# EAGLE design MotorDriverModule (EAGLE 9.6.2)
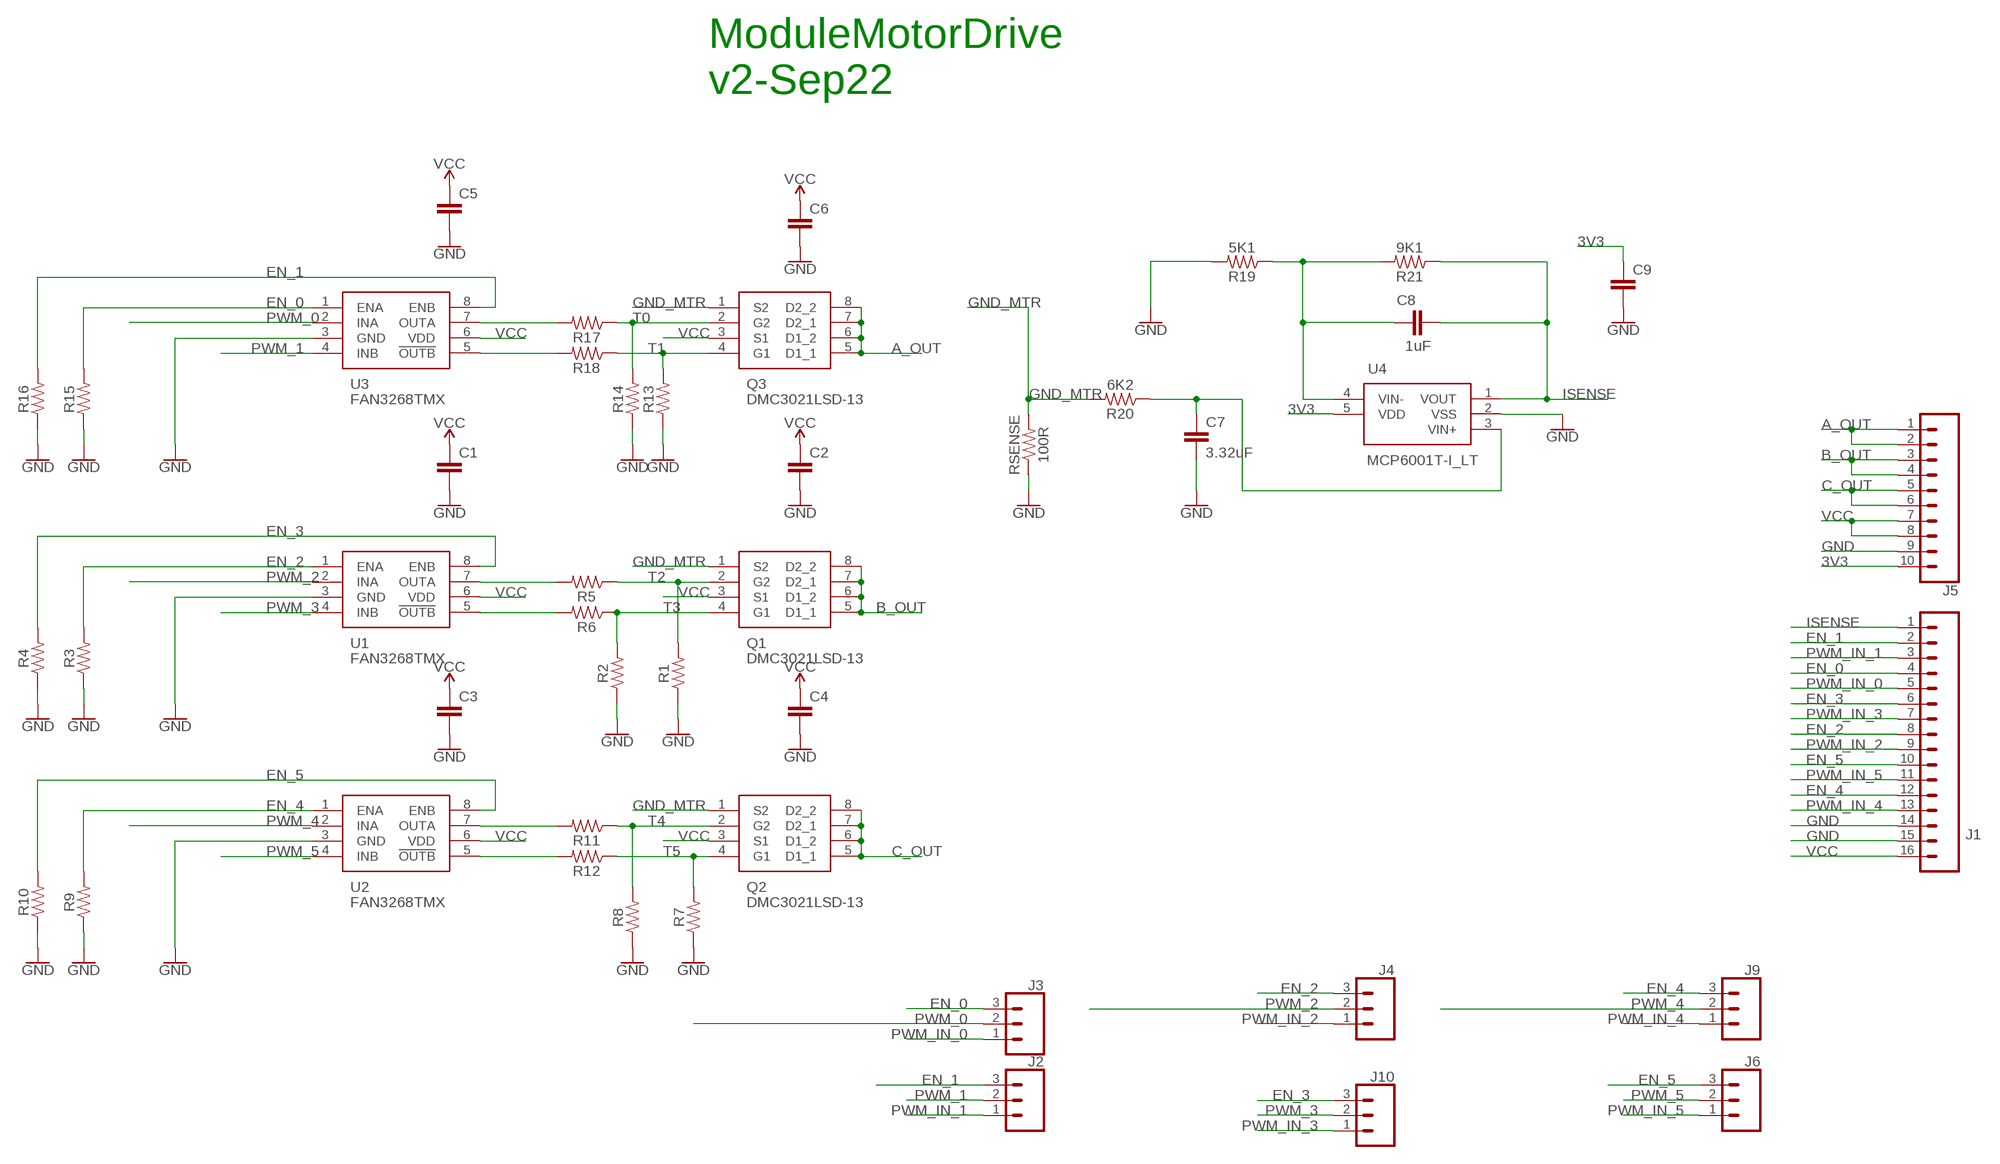
[diagram p0: schematic, sheet 1]

## Parts
C1  C-EUC0805  [C0805]
C2  C-EUC0805  [C0805]
C3  C-EUC0805  [C0805]
C4  C-EUC0805  [C0805]
C5  C-EUC0805  [C0805]
C6  C-EUC0805  [C0805]
C7  3.32uF  C-EUC0805  [C0805]
C8  1uF  C-EUC0805  [C0805]
C9  C-EUC0805  [C0805]
J1  CONN_16  [1X16]
J2  CONN_03  [1X03]
J3  CONN_03  [1X03]
J4  CONN_03  [1X03]
J5  CONN_10"  [1X10]
J6  CONN_03  [1X03]
J9  CONN_03  [1X03]
J10  CONN_03  [1X03]
Q1  DMC3021LSD-13  [SOIC127P600X175-8N]
Q2  DMC3021LSD-13  [SOIC127P600X175-8N]
Q3  DMC3021LSD-13  [SOIC127P600X175-8N]
R1  RESISTOR0805  [0805]
R2  RESISTOR0805  [0805]
R3  RESISTOR0805  [0805]
R4  RESISTOR0805  [0805]
R5  RESISTOR0805  [0805]
R6  RESISTOR0805  [0805]
R7  RESISTOR0805  [0805]
R8  RESISTOR0805  [0805]
R9  RESISTOR0805  [0805]
R10  RESISTOR0805  [0805]
R11  RESISTOR0805  [0805]
R12  RESISTOR0805  [0805]
R13  RESISTOR0805  [0805]
R14  RESISTOR0805  [0805]
R15  RESISTOR0805  [0805]
R16  RESISTOR0805  [0805]
R17  RESISTOR0805  [0805]
R18  RESISTOR0805  [0805]
R19  5K1  RESISTOR0805  [0805]
R20  6K2  RESISTOR0805  [0805]
R21  9K1  RESISTOR0805  [0805]
RSENSE  100R  RESISTOR1206  [1206]
U1  FAN3268TMX  [SOIC127P600X175-8N]
U2  FAN3268TMX  [SOIC127P600X175-8N]
U3  FAN3268TMX  [SOIC127P600X175-8N]
U4  MCP6001T-I_LT  [SOT65P210X110-5N]

## Nets
3V3: C9.1 J5.10 U4.5(VDD)
A_OUT: J5.1 J5.2 Q3.5(D1_1) Q3.6(D1_2) Q3.7(D2_1) Q3.8(D2_2)
B_OUT: J5.3 J5.4 Q1.5(D1_1) Q1.6(D1_2) Q1.7(D2_1) Q1.8(D2_2)
C_OUT: J5.5 J5.6 Q2.5(D1_1) Q2.6(D1_2) Q2.7(D2_1) Q2.8(D2_2)
EN_0: J1.4 J3.3 R15.2 U3.1(ENA)
EN_1: J1.2 J2.3 R16.2 U3.8(ENB)
EN_2: J1.8 J4.3 R3.2 U1.1(ENA)
EN_3: J1.6 J10.3 R4.2 U1.8(ENB)
EN_4: J1.12 J9.3 R9.2 U2.1(ENA)
EN_5: J1.10 J6.3 R10.2 U2.8(ENB)
GND: C1.2 C2.2 C3.2 C4.2 C5.2 C6.2 C7.2 C9.2 J1.14 J1.15 J5.9 R1.1 R2.1 R3.1 R4.1 R7.1 R8.1 R9.1 R10.1 R13.1 R14.1 R15.1 R16.1 R19.2 RSENSE.1 U1.3(GND) U2.3(GND) U3.3(GND) U4.2(VSS)
GND_MTR: Q1.1(S2) Q2.1(S2) Q3.1(S2) R20.2 RSENSE.2
ISENSE: C8.2 J1.1 R21.1 U4.1(VOUT)
N$2: C8.1 R19.1 R21.2 U4.4(VIN-)
N$3: C7.1 R20.1 U4.3(VIN+)
N$5: R6.2 U1.5(!OUTB)
N$6: R5.2 U1.7(OUTA)
N$14: R12.2 U2.5(!OUTB)
N$15: R11.2 U2.7(OUTA)
N$23: R18.2 U3.5(!OUTB)
N$24: R17.2 U3.7(OUTA)
PWM_0: J3.2 U3.2(INA)
PWM_1: J2.2 U3.4(INB)
PWM_2: J4.2 U1.2(INA)
PWM_3: J10.2 U1.4(INB)
PWM_4: J9.2 U2.2(INA)
PWM_5: J6.2 U2.4(INB)
PWM_IN_0: J1.5 J3.1
PWM_IN_1: J1.3 J2.1
PWM_IN_2: J1.9 J4.1
PWM_IN_3: J1.7 J10.1
PWM_IN_4: J1.13 J9.1
PWM_IN_5: J1.11 J6.1
T0: Q3.2(G2) R14.2 R17.1
T1: Q3.4(G1) R13.2 R18.1
T2: Q1.2(G2) R1.2 R5.1
T3: Q1.4(G1) R2.2 R6.1
T4: Q2.2(G2) R8.2 R11.1
T5: Q2.4(G1) R7.2 R12.1
VCC: C1.1 C2.1 C3.1 C4.1 C5.1 C6.1 J1.16 J5.7 J5.8 Q1.3(S1) Q2.3(S1) Q3.3(S1) U1.6(VDD) U2.6(VDD) U3.6(VDD)

## Notes on the sheet
- ModuleMotorDrive
  v2-Sep22

## Library data of the parts
C1-C9 = rcl:C-EU: CAPACITOR, European symbol; SPICEPREFIX: C
J1 = SparkFun-Connectors:CONN_16: Multi connection point. Often used as Generic Header-pin footprint for 0.1 inch spaced/style header connections On any of the 0.1 inch spaced packages, you can populate with these: Break Away Headers - Straight <https://www.sparkfun.com/products/116> (PRT-00116) Break Away Male Headers - Right Angle <https://www.sparkfun.com/products/553> (PRT-00553) Female Headers <https://www.sparkfun.com/products/115> (PRT-00115) Break Away Headers - Machine Pin <https://www.sparkfun.com/products/117> (PRT-00117) Break Away Female Headers - Swiss Machine Pin <https://www.sparkfun.com/products/743> (PRT-00743) For SCREWTERMINALS and SPRING TERMINALS visit here: Screw Terimnals on SparkFun.com <https://www.sparkfun.com/search/results?term=Screw+Terminals> (5mm/3.5mm/2.54mm spacing) This device is also useful as a general connection point to wire up your design to another part of your project. Our various solder wires solder well into these plated through hole pads. Hook-Up Wire - Assortment (Stranded, 22 AWG) <https://www.sparkfun.com/products/11375> (PRT-11375) Hook-Up Wire - Assortment (Solid Core, 22 AWG) <https://www.sparkfun.com/products/11367> (PRT-11367) View the entire wire category on our website here <https://www.sparkfun.com/categories/141> Special notes: Molex polarized connector foot print use with SKU : PRT-08231 with associated crimp pins and housings. 1MM SMD Version SKU: PRT-10208 NOTES ON THE VARIANTS LOCK and LOCK_LONGPADS... This footprint was designed to help hold the alignment of a through-hole component (i.e. 6-pin header) while soldering it into place. You may notice that each hole has been shifted either up or down by 0.005 of an inch from it's more standard position (which is a perfectly straight line). This slight alteration caused the pins (the squares in the middle) to touch the edges of the holes. Because they are alternating, it causes a "brace" to hold the component in place. 0.005 has proven to be the perfect amount of "off-center" position when using our standard breakaway headers. Although looks a little odd when you look at the bare footprint, once you have a header in there, the alteration is very hard to notice. Also,if you push a header all the way into place, it is covered up entirely on the bottom side.
J2-J4 J6 J9 J10 = SparkFun-Connectors:CONN_03: Multi connection point. Often used as Generic Header-pin footprint for 0.1 inch spaced/style header connections On any of the 0.1 inch spaced packages, you can populate with these: Break Away Headers - Straight <https://www.sparkfun.com/products/116> (PRT-00116) Break Away Male Headers - Right Angle <https://www.sparkfun.com/products/553> (PRT-00553) Female Headers <https://www.sparkfun.com/products/115> (PRT-00115) Break Away Headers - Machine Pin <https://www.sparkfun.com/products/117> (PRT-00117) Break Away Female Headers - Swiss Machine Pin <https://www.sparkfun.com/products/743> (PRT-00743) Stackable Header - 3 Pin (Female, 0.1") <https://www.sparkfun.com/products/13875> (PRT-13875) For SCREWTERMINALS and SPRING TERMINALS visit here: Screw Terimnals on SparkFun.com <https://www.sparkfun.com/search/results?term=Screw+Terminals> (5mm/3.5mm/2.54mm spacing) This device is also useful as a general connection point to wire up your design to another part of your project. Our various solder wires solder well into these plated through hole pads. Hook-Up Wire - Assortment (Stranded, 22 AWG) <https://www.sparkfun.com/products/11375> (PRT-11375) Hook-Up Wire - Assortment (Solid Core, 22 AWG) <https://www.sparkfun.com/products/11367> (PRT-11367) View the entire wire category on our website here <https://www.sparkfun.com/categories/141> Special notes: Molex polarized connector foot print use with SKU : PRT-08232 with associated crimp pins and housings.
J5 = SparkFun-Connectors:CONN_10: Multi connection point. Often used as Generic Header-pin footprint for 0.1 inch spaced/style header connections On any of the 0.1 inch spaced packages, you can populate with these: Break Away Headers - Straight <https://www.sparkfun.com/products/116> (PRT-00116) Break Away Male Headers - Right Angle <https://www.sparkfun.com/products/553> (PRT-00553) Female Headers <https://www.sparkfun.com/products/115> (PRT-00115) Break Away Headers - Machine Pin <https://www.sparkfun.com/products/117> (PRT-00117) Break Away Female Headers - Swiss Machine Pin <https://www.sparkfun.com/products/743> (PRT-00743) Arduino Stackable Header - 10 Pin <https://www.sparkfun.com/products/11376> (PRT-11376) For SCREWTERMINALS and SPRING TERMINALS visit here: Screw Terimnals on SparkFun.com <https://www.sparkfun.com/search/results?term=Screw+Terminals> (5mm/3.5mm/2.54mm spacing) This device is also useful as a general connection point to wire up your design to another part of your project. Our various solder wires solder well into these plated through hole pads. Hook-Up Wire - Assortment (Stranded, 22 AWG) <https://www.sparkfun.com/products/11375> (PRT-11375) Hook-Up Wire - Assortment (Solid Core, 22 AWG) <https://www.sparkfun.com/products/11367> (PRT-11367) View the entire wire category on our website here <https://www.sparkfun.com/categories/141> Special notes: Molex polarized connector foot print use with SKU : PRT-08231 with associated crimp pins and housings. 1MM SMD Version SKU: PRT-10208 NOTES ON THE VARIANTS LOCK and LOCK_LONGPADS... This footprint was designed to help hold the alignment of a through-hole component (i.e. 6-pin header) while soldering it into place. You may notice that each hole has been shifted either up or down by 0.005 of an inch from it's more standard position (which is a perfectly straight line). This slight alteration caused the pins (the squares in the middle) to touch the edges of the holes. Because they are alternating, it causes a "brace" to hold the component in place. 0.005 has proven to be the perfect amount of "off-center" position when using our standard breakaway headers. Although looks a little odd when you look at the bare footprint, once you have a header in there, the alteration is very hard to notice. Also,if you push a header all the way into place, it is covered up entirely on the bottom side.; PROD_ID: CONN-11563
Q1-Q3 = DMC3021LSD-13:DMC3021LSD-13: MOSFET Dual N/P-Channel 30V 8.5A/7A SO8 Diodes Inc DMC3021LSD-13 Dual N/P-channel MOSFET Transistor, 8-Pin SOIC Source: Datasheet <https://www.diodes.com/assets/Datasheets/ds32152.pdf>; DESCRIPTION: MOSFET Dual N/P-Channel 30V 8.5A/7A SO8 Diodes Inc DMC3021LSD-13 Dual N/P-channel MOSFET Transistor, 8-Pin SOIC; HEIGHT: 1.75mm; MANUFACTURER_NAME: Diodes Inc.; MANUFACTURER_PART_NUMBER: DMC3021LSD-13; MOUSER_PART_NUMBER: 621-DMC3021LSD-13; MOUSER_PRICE-STOCK: https://www.mouser.co.uk/ProductDetail/Diodes-Incorporated/DMC3021LSD-13?qs=WZYOKEqGBpLz0mDfwbjxxA%3D%3D
R1-R21 RSENSE = SparkFun-Resistors:RESISTOR: Generic Resistor Package
U1-U3 = FAN3268TMX:FAN3268TMX: FAN3268TMX Source: Datasheet; ARROW_PART_NUMBER: FAN3268TMX; ARROW_PRICE-STOCK: https://www.arrow.com/en/products/fan3268tmx/on-semiconductor; DESCRIPTION: FAN3268TMX; HEIGHT: 1.75mm; MANUFACTURER_NAME: onsemi; MANUFACTURER_PART_NUMBER: FAN3268TMX; MOUSER_PART_NUMBER: 512-FAN3268TMX; MOUSER_PRICE-STOCK: https://www.mouser.co.uk/ProductDetail/ON-Semiconductor-Fairchild/FAN3268TMX/?qs=cjOFguiotuKeCt2NyaHM9g%3D%3D
U4 = MCP6001T-I_LT:MCP6001T-I_LT: Microchip MCP6001T-I/LT Low Power Op Amp, 1MHz Rail-Rail, 1.8 6 V, 5-Pin SC-70 Source: Datasheet <http://componentsearchengine.com/Datasheets/3/MCP6001T-I_LT.pdf>; ARROW_PART_NUMBER: MCP6001T-I/LT; ARROW_PRICE-STOCK: https://www.arrow.com/en/products/mcp6001t-ilt/microchip-technology?region=nac; DESCRIPTION: Microchip MCP6001T-I/LT Low Power Op Amp, 1MHz Rail-Rail, 1.8 6 V, 5-Pin SC-70; HEIGHT: 1.1mm; MANUFACTURER_NAME: Microchip; MANUFACTURER_PART_NUMBER: MCP6001T-I/LT; MOUSER_PART_NUMBER: 579-MCP6001T-I/LT; MOUSER_PRICE-STOCK: https://www.mouser.co.uk/ProductDetail/Microchip-Technology-Atmel/MCP6001T-I-LT?qs=Q%2Fw7XRh99il03y7Zr5Ze0Q%3D%3D

## Board
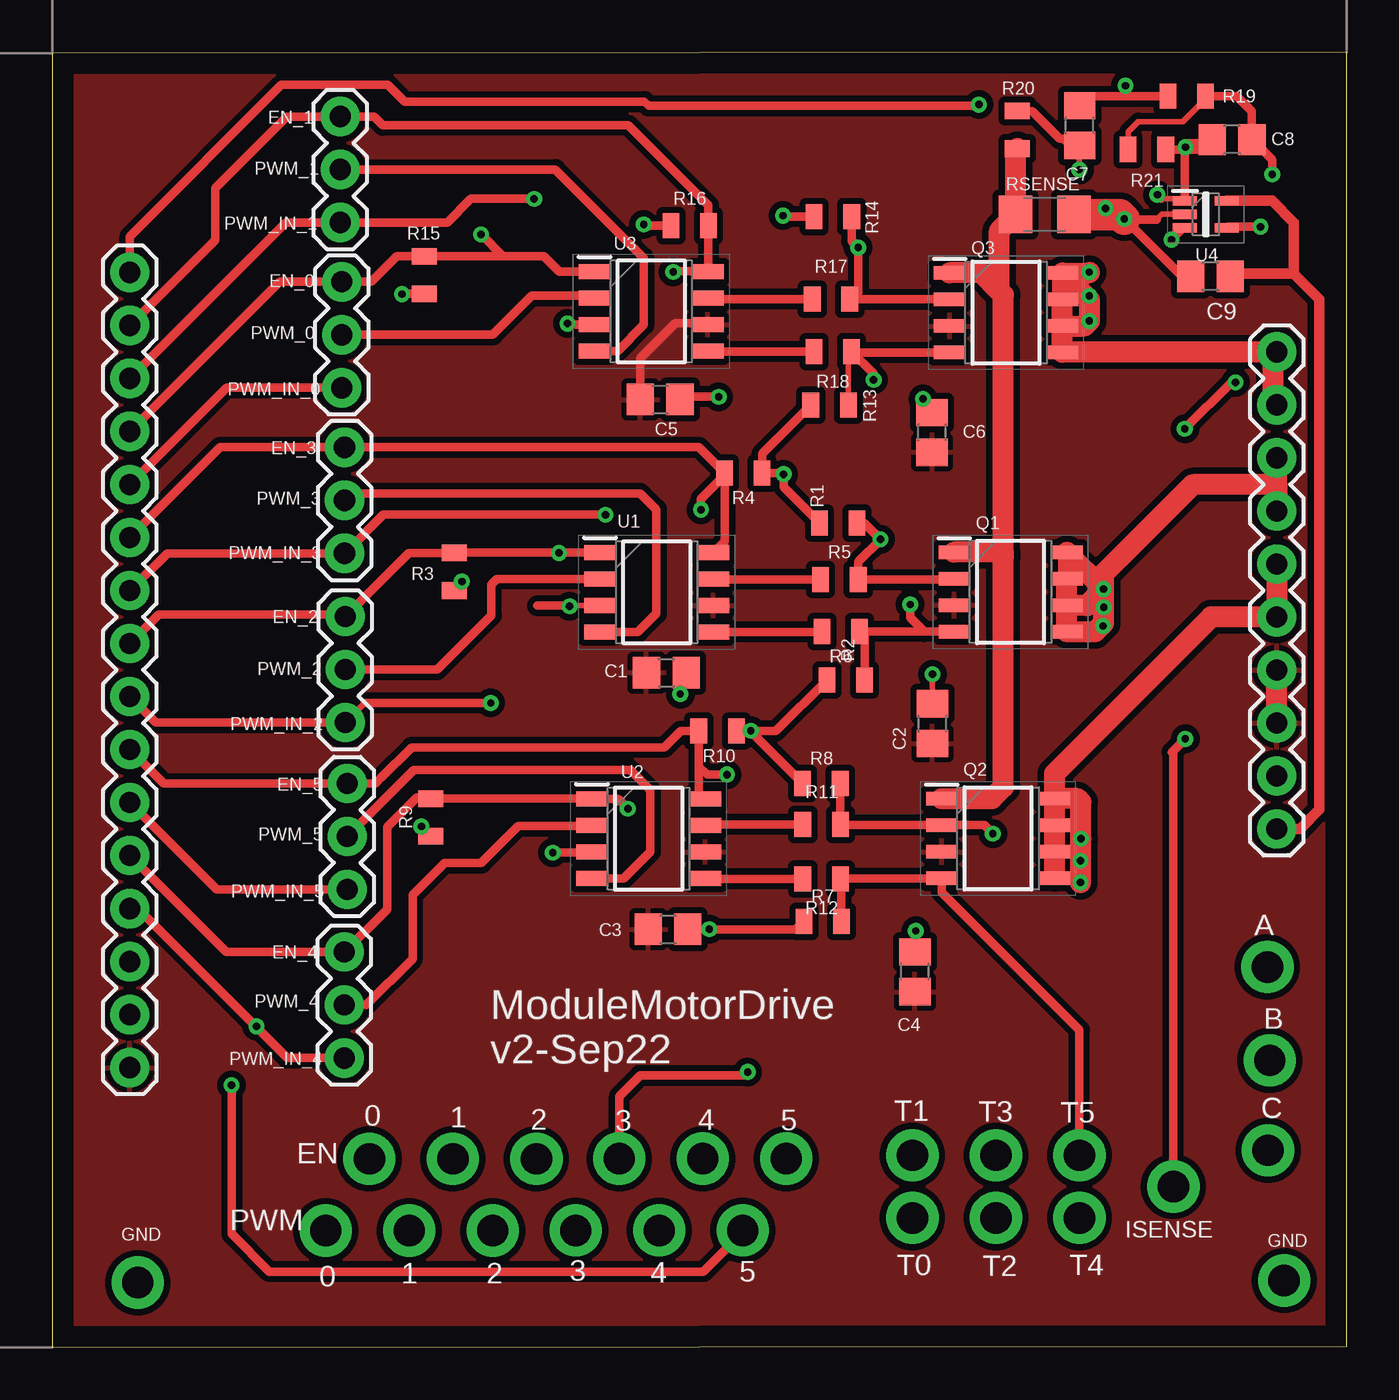
[diagram p1: board, top side]
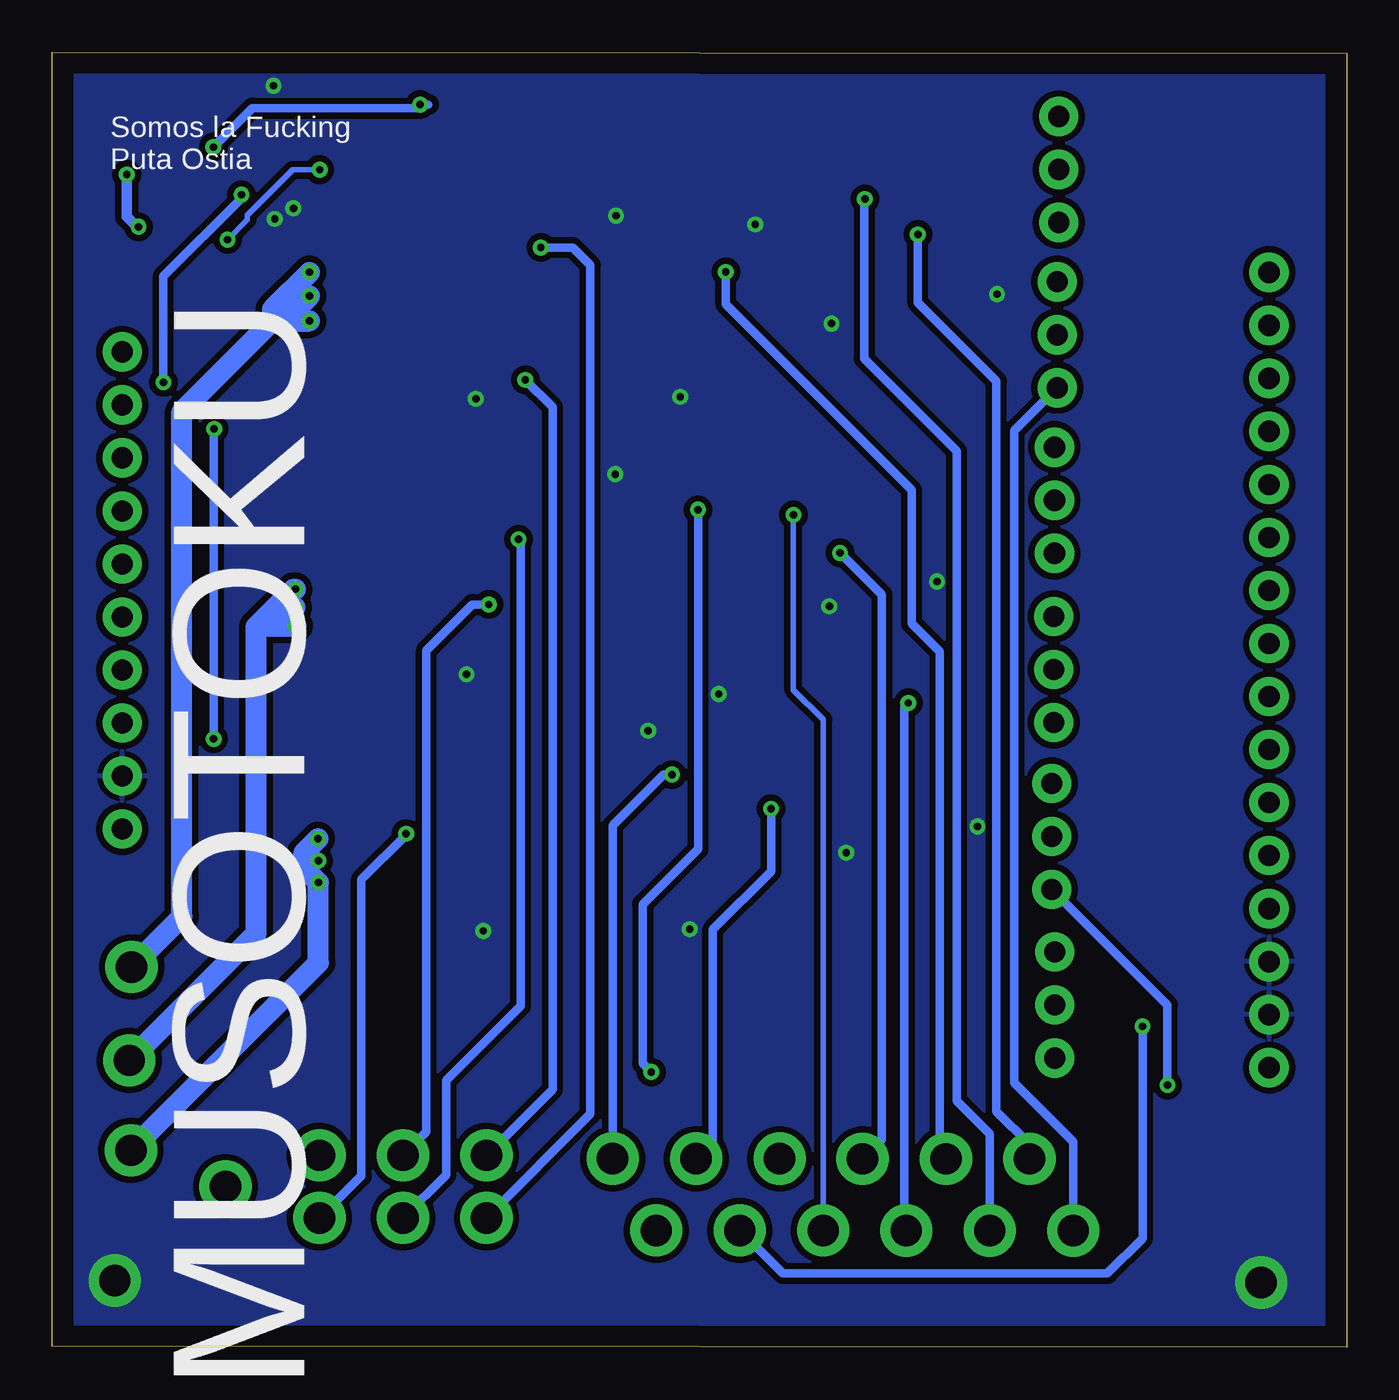
[diagram p2: board, bottom side, seen from below]

Size 62 x 62.05 mm. Coordinates in mm from the lower left corner, seen from the top.
Outline: 0,0 62,0.05 62,62.05 0,62 0,0
Copper layers (1*16): Top 0.035mm / dielectric 1.5mm / Bottom 0.035mm
Design rules "default *": minimum track width 6mil, minimum drill 0.35mm, track to track 12mil, track to pad 12mil, pad to pad 12mil, via to via 12mil, smd to smd 6mil, copper to edge 40mil, drill to drill 6mil, minimum pad ring 10mil, minimum via ring 8mil, stop-mask expansion 4mil, vias tented up to drill 0mil, thermal gap 10mil

### Footprints (pad centres in the part's own frame; a part is rotated, then mirrored left to right if it is on the bottom)
C0805 = smd 1.3 x 1.5: 1 -0.95,0; 2 0.95,0
1X16 = drill 1.016 pad 1.88: 1 0,0; 2 2.54,0; 3 5.08,0; 4 7.62,0; 5 10.16,0; 6 12.7,0; 7 15.24,0; 8 17.78,0; 9 20.32,0; 10 22.86,0; 11 25.4,0; 12 27.94,0; 13 30.48,0; 14 33.02,0; 15 35.56,0; 16 38.1,0
1X03 = drill 1.016 pad 1.88: 1 0,0; 2 2.54,0; 3 5.08,0
1X10 = drill 1.016 pad 1.88: 1 0,0; 2 2.54,0; 3 5.08,0; 4 7.62,0; 5 10.16,0; 6 12.7,0; 7 15.24,0; 8 17.78,0; 9 20.32,0; 10 22.86,0
SOIC127P600X175-8N = smd 1.5 x 0.65: 1 -2.7,1.905; 2 -2.7,0.635; 3 -2.7,-0.635; 4 -2.7,-1.905; 5 2.7,-1.905; 6 2.7,-0.635; 7 2.7,0.635; 8 2.7,1.905
0805 = smd 0.8 x 1.2: 1 -0.9,0; 2 0.9,0
1206 = smd 1.6 x 1.8: 1 -1.4,0; 2 1.4,0
SOIC127P600X175-8N' = smd 1.525 x 0.7: 1 -2.712,1.905; 2 -2.712,0.635; 3 -2.712,-0.635; 4 -2.712,-1.905; 5 2.712,-1.905; 6 2.712,-0.635; 7 2.712,0.635; 8 2.712,1.905
SOT65P210X110-5N = smd 1.15 x 0.45: 1 -1,0.65; 2 -1,0; 3 -1,-0.65; 4 1,-0.65; 5 1,0.65

### Placement (x,y rotation side)
C1  29.41,32.32 0 top
C2  42.16,29.88 90 top
C3  29.49,20.03 0 top
C4  41.32,17.99 90 top
C5  29.12,45.41 0 top
C6  42.14,43.83 90 top
C7  49.21,58.53 90 top
C8  56.51,57.86 180 top
C9  55.47,51.3 180 top
J1  3.72,51.5 270 top
J2  13.79,53.89 90 top
J3  13.87,45.97 90 top
J4  14.03,29.93 90 top
J5  58.65,47.69 270 top
J6  14.13,21.94 90 top
J9  13.99,13.86 90 top
J10  14,38.04 90 top
Q1  45.9,36.19 0 top
Q2  45.3,24.38 0 top
Q3  45.68,49.57 0 top
R1  37.65,39.5 0 top
R2  38.01,31.98 0 top
R3  19.25,37.16 90 top
R4  33.1,41.89 180 top
R5  37.7,36.79 180 top
R6  37.77,34.3 180 top
R7  36.9,20.41 0 top
R8  36.84,27.02 0 top
R9  18.14,25.39 90 top
R10  31.87,29.52 180 top
R11  36.85,25.05 180 top
R12  36.85,22.44 180 top
R13  37.23,45.14 0 top
R14  37.39,54.16 0 top
R15  17.81,51.37 90 top
R16  30.53,53.74 0 top
R17  37.3,50.22 180 top
R18  37.38,47.71 180 top
R19  54.34,59.93 180 top
R20  46.22,58.33 270 top
R21  52.43,57.39 180 top
RSENSE  47.54,54.27 180 top
U1  FAN3268TMX  [SOIC127P600X175-8N']  28.95,36.17 0 top
U2  FAN3268TMX  [SOIC127P600X175-8N']  28.56,24.37 0 top
U3  FAN3268TMX  [SOIC127P600X175-8N']  28.69,49.63 0 top
U4  55.25,54.28 0 top

### Tracks (layer width: path | path; a pad name or v marks a point on that pad's centre or on a via)
3V3
  Top 0.406: 56.57,51.45 C9.1
  Top 0.508: J5.10 59.76,24.83 60.69,25.76 60.69,50.22 59.46,51.45 | 59.46,51.45 56.57,51.45 | U4.5 58.42,54.93 59.46,53.89 59.46,51.45
A_OUT  (via drill 0.35, 1.5 pad 2.5)
  Top 0.254: J5.1 58.48,47.69 48.41,47.69 Q3.5 48.38,47.91 48.38,48.89 Q3.6 | 48.38,50.03 Q3.7
  Top 1.016: J5.2 58.48,45.32 58.48,47.69 | J5.1 48.6,47.69 48.38,47.91 | Q3.5 48.38,48.89 | 48.38,50.03 Q3.6 49.44,48.94 v49.67,49.17 49.67,50.19 Q3.8 | Q3.8 Q3.7 | Q3.8 49.64,51.48 v49.67,51.51
  Bottom 1.016: v58.2,18.22 55.79,20.63 55.79,44.83 51.45,49.17 | 51.45,49.17 v49.67,49.17 | v49.67,51.51 51.45,49.73 | 51.45,49.73 51.45,49.17 | v49.67,50.37 50.31,49.73 51.45,49.73
B_OUT  (via drill 0.35, 1.5 pad 2.5)
  Top 0.254: 48.6,36.63 Q1.7 | 48.6,35.53 Q1.6
  Top 1.016: Q1.6 48.6,36.63 | Q1.7 48.66,36.89 48.66,38.04 Q1.8 48.6,38.08 v50.35,36.33 | J5.3 J5.4 58.65,41.31 58.63,41.33 54.61,41.33 50.35,37.07 v50.35,36.33 | v50.35,36.33 49.55,35.53 48.6,35.53 Q1.5 49.94,34.29 50.35,34.69 v50.35,36.33
  Bottom 1.016: v58.31,13.75 52.23,19.83 52.23,34.53 52.2,34.56 | 52.2,34.56 50.43,36.33 v50.35,36.33 | 52.2,34.56 51.82,34.56 | 51.82,34.56 v50.33,34.56 | 51.82,34.56 50.92,35.46 v50.36,35.46
C_OUT  (via drill 0.35, 1.5 pad 2.5)
  Top 0.254: 48,26.57 Q2.8 | 48,25.11 Q2.7 | 48,23.89 Q2.6 | 48,22.64 Q2.5
  Top 1.016: J5.5 J5.6 55.51,34.99 48,27.48 48,26.57 | 48,25.11 Q2.8 49.11,26.29 49.27,26.12 v49.27,24.37 49.25,24.35 v49.25,23.31 v49.25,22.27 | Q2.7 48,23.89 | Q2.6 48,22.64
  Bottom 1.016: v58.23,9.44 49.25,18.42 v49.25,22.27 49.91,22.93 49.95,22.93 49.95,23.69 v49.27,24.37
EN_0  (via drill 0.35, 1.5 pad 2.5)
  Top 0.254: J3.3 14.05,51.05
  Top 0.406: 21.59,52.27 R15.2 16.5,52.27 15.28,51.05 14.05,51.05 10.89,51.05 J1.4 | 21.59,52.27 23.55,52.27 24.28,51.54 U3.1 | v20.54,53.32 21.59,52.27
  Bottom 0.406: v15.19,9.03 15.19,9.72 16.78,11.31 16.78,46.28 20.54,50.04 v20.54,53.32
EN_1  (via drill 0.35, 1.5 pad 2.5)
  Top 0.152: J2.3 12.42,58.97
  Top 0.254: 31.43,51.57 U3.8 | v29.74,51.52 29.79,51.57
  Top 0.406: 29.79,51.57 31.43,51.57 R16.2 31.43,54.71 27.59,58.55 15.84,58.55 15.42,58.97 12.42,58.97 11.24,58.97 7.8,55.53 7.8,53.04 J1.2
  Bottom 0.406: v19.19,9.03 19.5,9.34 19.5,33.34 20.84,34.68 20.84,41.07 29.74,49.97 v29.74,51.52
EN_2  (via drill 0.35, 1.5 pad 2.5)
  Top 0.254: R3.2 19.27,38.08 | 14.12,35.11 J4.3
  Top 0.406: 19.27,38.08 24.29,38.08 | 24.29,38.08 U1.1 | R3.2 17.08,38.06 14.12,35.11 5.1,35.11 J1.8 | v24.27,38.06 24.29,38.08
  Bottom 0.406: v23.19,9.03 22.27,9.95 22.27,36.06 v24.27,38.06
EN_3  (via drill 0.35, 1.5 pad 2.5)
  Top 0.254: R4.2 32.2,41.78
  Top 0.406: R4.2 30.97,43.12 J10.3 8.04,43.12 J1.6 | U1.8 32.2,38.61 32.2,41.78 31.07,40.65 v31.07,40.13 | v27.16,9.04 27.16,12.03 28.16,13.03 33.31,13.03 v33.31,13.19
  Bottom 0.406: v33.31,13.19 33.72,13.6 33.72,21.22 31.07,23.87 v31.07,40.13
EN_4  (via drill 0.35, 1.5 pad 2.5)
  Top 0.254: R9.2 18.08,26.35 17.47,26.35
  Top 0.406: 17.47,26.35 16.04,24.92 16.04,20.99 J9.3 8.34,18.94 J1.12 | R9.2 25.83,26.29 U2.1 27.1,26.27 v27.57,25.8
  Bottom 0.406: v31.16,9.04 30.36,9.84 30.36,20.01 27.57,22.8 v27.57,25.8
EN_5  (via drill 0.35, 1.5 pad 2.5)
  Top 0.406: 30.97,27.84 R10.2 30.1,29.52 29.32,28.74 17.21,28.74 15.74,27.27 15.49,27.02 J6.3 5.34,27.02 J1.10 | 30.97,27.84 30.97,26.58 U2.8 | v32.32,27.44 31.37,27.44 30.97,27.84
  Bottom 0.406: v35.16,9.04 35.16,25 32.72,27.44 v32.32,27.44
GND  (via drill 0.35, 1.5 pad 2.5)
  Top 0.254: v42.16,32.25 C2.2 | C5.2 30.2,45.54 | U1.3 24.82,35.54 v24.78,35.5 | v19.62,36.69 19.25,36.32 R3.1 | U2.3 25.82,23.7 | 33.46,29.52 v33.46,29.54 | 49.04,54.27 RSENSE.1 49.21,54.54 | U4.2 53.15,54.28 52.9,54.03 | 51.24,59.93 51.4,60.09 v51.4,60.45
  Top 0.406: C3.2 30.82,20.03 | 30.82,20.03 v31.46,20.04 v31.47,20.03 | v41.36,19.95 41.36,18.98 C4.2 | C1.2 30.08,32.04 v30.08,31.3 | v41.71,45.44 42.13,45.02 C6.2 | v31.92,45.54 30.2,45.54 | v17.68,24.95 R9.1 | R15.1 v16.76,50.47 v16.75,50.46 | 25.82,23.7 v23.97,23.7 | R10.1 33.46,29.52 | U3.3 24.73,49 v24.68,49.05 | R16.1 28.39,53.74 v28.33,53.8 | RSENSE.1 49.18,54.03 52.9,54.03 | 54.25,51.57 C9.2 54.12,51.3 51.36,54.06 v51.34,54.06 | 23.24,35.54 24.82,35.54 | C7.2 49.66,59.93 51.24,59.93 R19.2 | R13.1 34,42.81 R4.1 34.97,41.89 v35.03,41.83 35.03,41.22 R1.1 | R14.1 35.1,54.16 35.08,54.14 v35,54.22 | R2.1 34.65,29.52 33.46,29.52 | R8.1 33.46,29.5 33.46,29.52 | R7.1 35.62,20.03 30.82,20.03
  Top 1.5: v51.34,54.06 51.13,54.27 RSENSE.1
  other vias: 50.45,54.57 4.1,3.1 59,3.2
  pour Bottom (isolate 0.254): -1.17,62 62.8,62 62.8,0 -1.17,0
GND_MTR
  Top 1.016: Q2.1 45,26.29 45.55,26.84 45.55,37.88 45.55,38.1 | 45.55,38.1 Q1.1 | Q3.1 44.49,51.48 45.37,50.61 | 45.55,38.1 45.55,50.42 45.37,50.61 | R20.2 46.14,57.35 RSENSE.2 45.37,53.5 45.37,50.61
ISENSE  (via drill 0.35, 1.5 pad 2.5)
  Top 0.254: v54.28,57.5 54.28,57.7 | 53.7,28.43 53.62,28.51 | 54.25,55.04 53.11,55.04
  Top 0.406: U4.1 54.25,55.04 54.25,57.39 | 54.28,57.7 55.4,57.7 C8.2 55.09,57.39 54.25,57.39 | 54.25,57.39 R21.1 | v53.7,7.7 53.7,28.43 | 53.62,28.51 v54.27,29.15 | J1.1 3.72,53.22 10.98,60.48 16.08,60.48 16.88,59.68 28.36,59.68 28.57,59.48 44.32,59.48 v44.38,59.54 | v52.93,55.22 53.11,55.04 | v54.25,44.01 56.47,46.23 v56.67,46.23
  Bottom 0.254: 54.25,57.47 v54.28,57.5
  Bottom 0.406: v54.28,57.5 52.41,59.37 44.55,59.37 v44.38,59.54 43.98,59.54 | 3.66,51.56 J1.1 | v54.27,29.15 54.27,43.98 v54.25,44.01 | v56.67,46.23 56.67,51.32 52.93,55.06 v52.93,55.22
N$2  (via drill 0.35)
  Top 0.254: R21.2 51.53,58.23 52.02,58.72 54.17,58.72 54.17,58.75 55.24,59.82 R19.1
  Top 0.406: v58.43,56.19 58.43,56.89 C8.1 57.46,59.21 56.74,59.93 R19.1 | v57.87,53.69 56.31,53.69 U4.4
  Bottom 0.406: 57.9,53.65 v57.87,53.69
  Bottom 0.508: v58.43,56.19 58.43,54.18 57.9,53.65
N$3  (via drill 0.35)
  Top 0.254: R20.1 46.29,59.3 | U4.3 53.65,53.03 53.64,53.03 v53.6,53.07 | v49.19,56.42 49.19,57.15 49.19,57.56 C7.1
  Top 0.406: 49.19,57.15 48.44,57.9 48.26,57.9 46.93,59.23 R20.1
  Bottom 0.254: v53.6,53.07 52.65,54.02 52.65,54.24 50.48,56.41 v49.2,56.41 v49.19,56.42
N$5
  Top 0.254: R6.2 36.84,34.27
  Top 0.406: 36.84,34.27 U1.5
N$6
  Top 0.254: 31.68,36.79 U1.7
  Top 0.406: R5.2 31.68,36.79
N$14
  Top 0.254: 31.93,22.44 31.72,22.23 31.51,22.23 U2.5
  Top 0.406: R12.2 31.93,22.44
N$15
  Top 0.254: 31.32,25.05 U2.7
  Top 0.406: R11.2 31.32,25.05
N$23
  Top 0.254: 31.42,47.71 U3.5
  Top 0.406: R18.2 31.42,47.71
N$24
  Top 0.254: 31.45,50.22 U3.7
  Top 0.406: R17.2 31.45,50.22
PWM_0
  Top 0.254: 25.86,50.38 U3.2
  Top 0.406: 25.86,50.38 22.97,50.38 21.1,48.51 J3.2
PWM_1
  Top 0.254: 25.9,47.65 U3.4
  Top 0.406: J2.2 24.1,56.43 28.34,52.19 28.34,48.99 27.08,47.73 U3.4
PWM_2
  Top 0.406: J4.2 18.43,32.47 21.03,35.07 21.03,36.54 21.3,36.81 U1.2
PWM_3
  Top 0.254: 26.18,34.21 U1.4
  Top 0.406: J10.2 14.33,40.91 28.16,40.91 28.93,40.14 28.93,35.15 28.05,34.27 U1.4
PWM_4
  Top 0.254: 25.82,24.97 U2.2
  Top 0.406: J9.2 15.04,16.4 17.26,18.62 17.26,21.67 18.79,23.2 20.56,23.2 22.33,24.97 25.82,24.97
PWM_5
  Top 0.254: 25.8,22.51 U2.4
  Top 0.406: J6.2 17.32,27.67 27.68,27.67 28.65,26.7 28.65,23.74 27.37,22.46 U2.4
PWM_IN_0  (via drill 1.5 pad 2.5)
  Top 0.406: J1.5 8.35,45.97 J3.1
  Bottom 0.406: v13.1,5.59 13.1,9.84 15.92,12.66 15.92,43.92 J3.1
PWM_IN_1  (via drill 0.35, 1.5 pad 2.5)
  Top 0.406: v23.08,55.02 20.04,55.02 18.91,53.89 J2.1 11.19,53.89 J1.3
  Bottom 0.254: v23.08,55.02 23.12,54.98
  Bottom 0.406: v17.1,5.59 17.1,10.22 18.68,11.8 18.68,42.93 23.12,47.37 23.12,54.98
PWM_IN_2  (via drill 0.35, 1.5 pad 2.5)
  Top 0.254: 14.97,30.87 J4.1
  Top 0.406: v21,30.87 14.97,30.87 | J1.9 4.96,29.93 J4.1
  Bottom 0.406: v21.1,5.59 21.2,5.69 21.2,30.67 v21,30.87
PWM_IN_3  (via drill 0.35, 1.5 pad 2.5)
  Top 0.406: v26.5,39.89 15.85,39.89 J10.1 5.5,38.04 J1.7
  Bottom 0.254: v25.07,5.6 25.07,30.07 26.5,31.5 v26.5,39.89
PWM_IN_4  (via drill 0.35, 1.5 pad 2.5)
  Top 0.406: 9.84,15.27 11.25,13.86 J9.1 | 9.84,15.27 4.09,21.02 J1.13 | v9.78,15.38 9.86,15.3 9.84,15.27
  Bottom 0.406: v29.07,5.6 27.01,3.54 11.46,3.54 9.78,5.22 v9.78,15.38
PWM_IN_5  (via drill 0.35, 1.5 pad 2.5)
  Top 0.406: v33.07,5.6 33.07,5.51 31.19,3.63 10.4,3.63 8.6,5.43 v8.6,12.55 v8.59,12.56 | J1.11 7.88,21.94 J6.1
  Bottom 0.406: v8.59,12.56 8.59,16.4 J6.1
T0  (via drill 0.35, 1.5 pad 2.5)
  Top 0.254: R17.1 38.31,50.22 | 42.97,50.22 Q3.2
  Top 0.406: 42.97,50.22 38.31,50.22 38.6,50.51 v38.6,52.69 38.29,53 R14.2
  Bottom 0.406: v41.2,6.2 36.22,11.18 36.22,51.84 37.07,52.69 v38.6,52.69
T1  (via drill 0.35, 1.5 pad 2.5)
  Top 0.254: 38.33,47.67 R18.1 38.13,47.56 R13.2
  Top 0.406: Q3.4 38.33,47.67 | R18.1 39.34,46.65 v39.34,46.35
  Bottom 0.406: v41.2,9.2 38.03,12.37 38.03,45.04 v39.34,46.35
T2  (via drill 0.35, 1.5 pad 2.5)
  Top 0.254: 43.17,36.79 Q1.2
  Top 0.406: 43.17,36.79 R5.1 38.6,37.64 v39.67,38.71 38.88,39.5 R1.2
  Bottom 0.254: 39.56,38.6 v39.67,38.71
  Bottom 0.406: v45.2,6.2 43.13,8.27 43.13,12.78 39.56,16.35 39.56,38.6
T3  (via drill 0.35, 1.5 pad 2.5)
  Top 0.254: 38.69,34.29 R6.1
  Top 0.406: Q1.4 41.76,34.29 | 41.76,34.29 38.69,34.29 38.91,34.06 R2.2 | v41.09,35.59 41.09,34.96 41.76,34.29
  Bottom 0.406: v45.2,9.2 44.08,10.32 44.08,33.39 41.88,35.59 v41.09,35.59
T4  (via drill 0.35, 1.5 pad 2.5)
  Top 0.254: 37.78,25.02 R11.1
  Top 0.406: 37.78,25.02 Q2.2 44.64,25.02 v45.05,24.61 | R8.2 R11.1
  Bottom 0.254: 45.05,24.55 v45.05,24.61
  Bottom 0.406: v49.2,6.2 47.19,8.21 47.19,22.41 45.05,24.55
T5  (via drill 1.5 pad 2.5)
  Top 0.254: 37.78,22.47 R12.1
  Top 0.406: v49.2,9.2 49.2,15.2 42.6,21.8 Q2.4 37.78,22.47 37.8,22.46 R7.2
VCC
  Top 0.254: 58.65,32.11 J5.7
  Top 0.406: C5.1 28.17,47.4 29.83,49.06 31.34,49.06 U3.6
  Top 1.016: J5.8 58.65,32.11
  pour Top (isolate 0.254): -2.74,0 -2.74,62 62.64,62 62.64,0

### Text on the board
tPlace: EN_1 | PWM_1 | PWM_IN_1 | EN_0 | PWM_0 | PWM_IN_0 | EN_3 | PWM_3 | PWM_IN_3 | EN_2 | PWM_2 | PWM_IN_2 | EN_5 | PWM_5 | PWM_IN_5 | A | EN_4 | PWM_4 | B | PWM_IN_4 | ModuleMotorDrive / v2-Sep22 | T1 | T3 | T5 | C | 0 | 1 | 2 | 3 | 4 | 5 | EN | ISENSE | GND | PWM | GND | 0 | 1 | 2 | 3 | 4 | 5 | T0 | T2 | T4
bPlace: Somos la Fucking / Puta Ostia | MUSOTOKU